# EAGLE design ButtonPad (EAGLE 8.5.0)
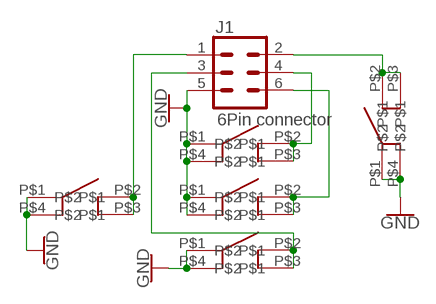
[diagram p0: schematic, sheet 1]

## Parts
J1  6Pin connector  CONN_03X22X3_SILK_MALE_PTH  [2X3]
U$1  BUTTON_GRAY_12MM  [BUTTON_12MM]
U$2  BUTTON_GRAY_12MM  [BUTTON_12MM]
U$3  BUTTON_GRAY_12MM  [BUTTON_12MM]
U$4  BUTTON_GRAY_12MM  [BUTTON_12MM]
U$5  BUTTON_GRAY_12MM  [BUTTON_12MM]

## Nets
GND: J1.5 U$1.P$1 U$1.P$4 U$2.P$1 U$2.P$4 U$3.P$1 U$3.P$4 U$4.P$1 U$4.P$4 U$5.P$1 U$5.P$4
N$1: J1.1 U$5.P$2 U$5.P$3
N$2: J1.3 U$3.P$2 U$3.P$3
N$3: J1.6 U$2.P$2 U$2.P$3
N$4: J1.4 U$1.P$2 U$1.P$3
N$5: J1.2 U$4.P$2 U$4.P$3

## Library data of the parts
J1 = SparkFun-Connectors:CONN_03X2: Multi connection point. Often used as Generic Header-pin footprint for 0.1 inch spaced/style header connections You can populate with any combo of single row headers, but if you'd like an exact match, check these: Header - 2x3 (Male, 0.1") <https://www.sparkfun.com/products/12807> (PRT-12807) Header - 2x3 (Female, 0.1") <https://www.sparkfun.com/products/13010> (PRT-13010) 2x3 Pin Shrouded Header <https://www.sparkfun.com/products/10877> (PRT-10877) On any of the 0.1 inch spaced packages, you can populate with these: Break Away Headers - Straight <https://www.sparkfun.com/products/116> (PRT-00116) Break Away Male Headers - Right Angle <https://www.sparkfun.com/products/553> (PRT-00553) Female Headers <https://www.sparkfun.com/products/115> (PRT-00115) Break Away Headers - Machine Pin <https://www.sparkfun.com/products/117> (PRT-00117) Break Away Female Headers - Swiss Machine Pin <https://www.sparkfun.com/products/743> (PRT-00743) Special note: the shrouded connector mates well with our 3x2 ribbon cables: Ribbon Crimp Connector - 6-pin (2x3, Female) <https://www.sparkfun.com/products/10651> (PRT-10651) Ribbon Cable - 6 wire (15ft) <https://www.sparkfun.com/products/10646> (PRT-10646); PROD_ID: CONN-09701
U$1-U$5 = HTXstuff:BUTTON_GRAY_12MM

## Board
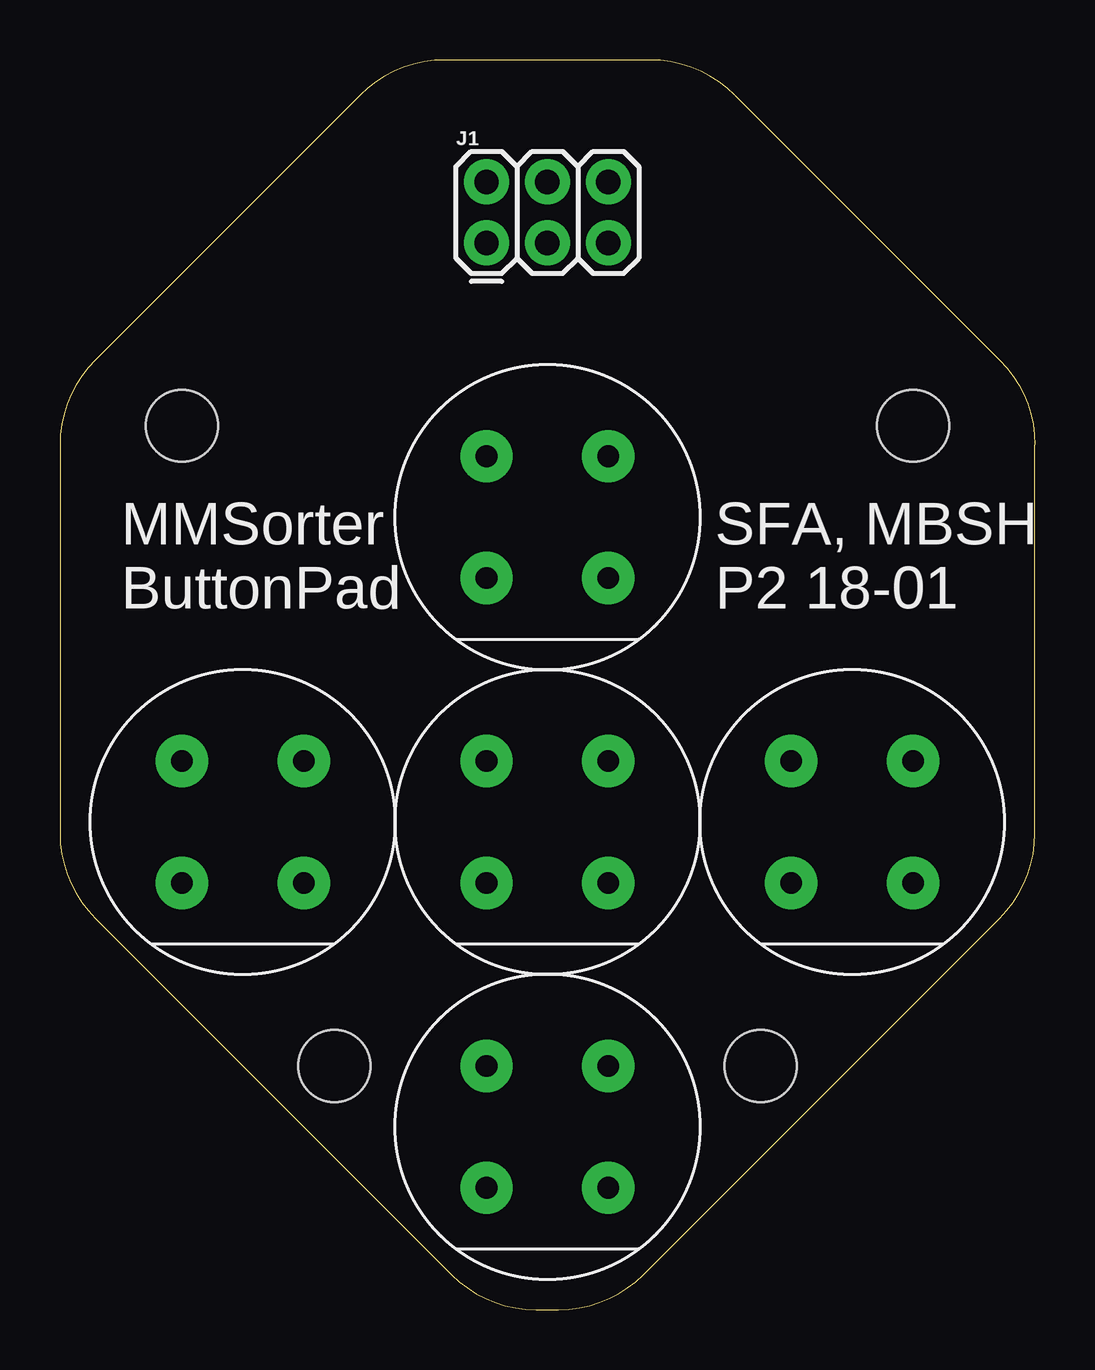
[diagram p1: board, top side]
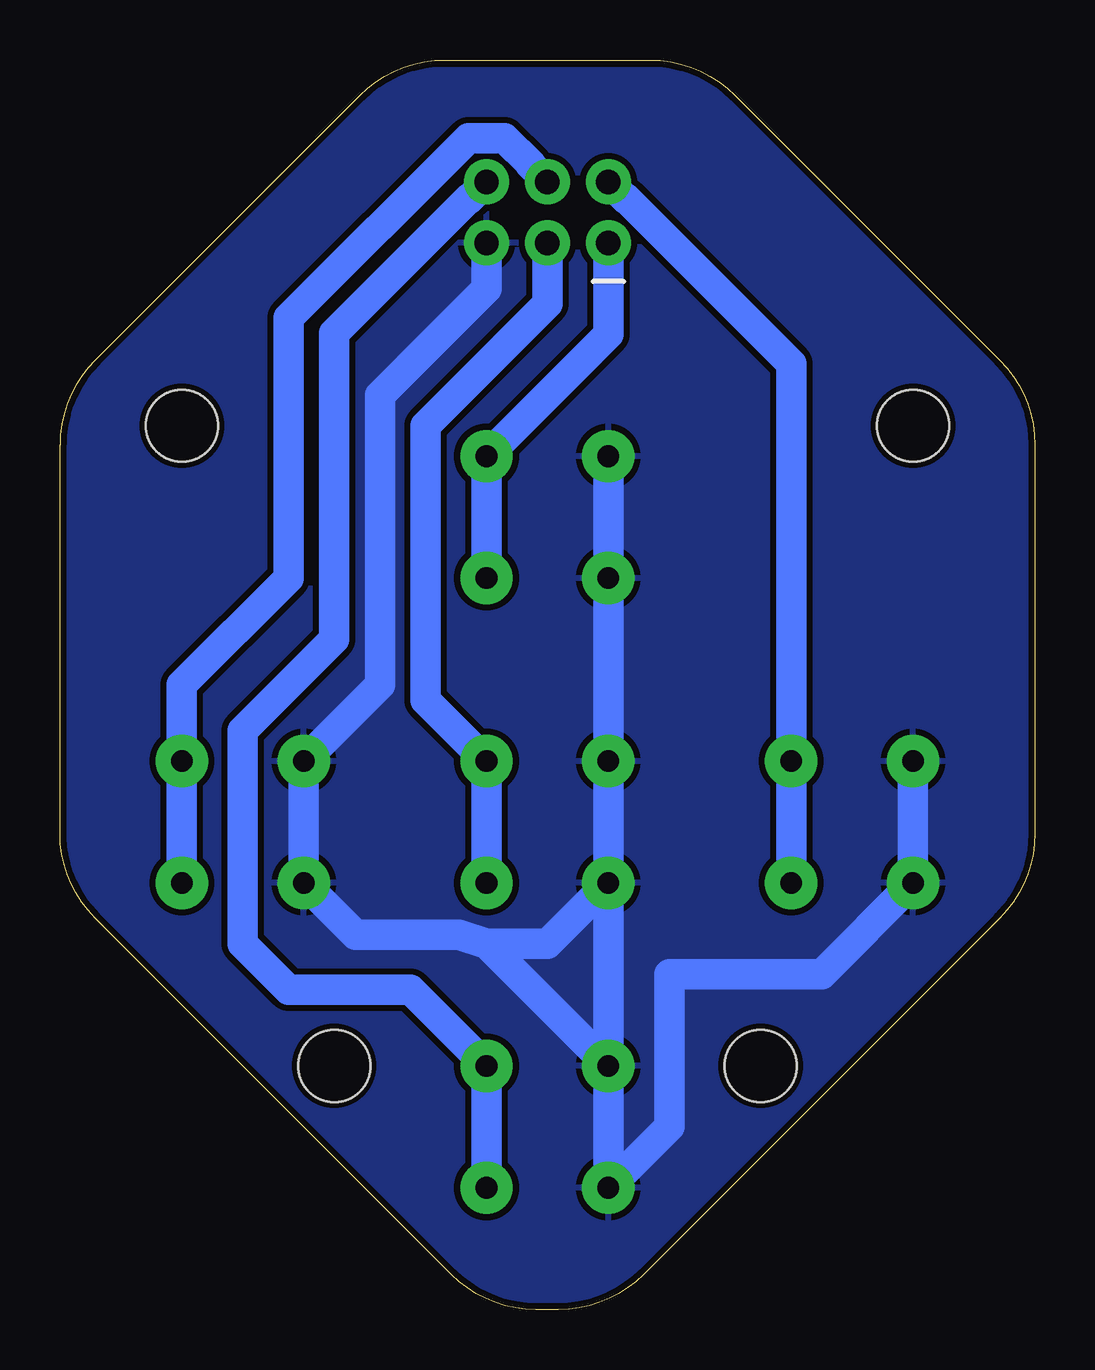
[diagram p2: board, bottom side, seen from below]

Size 40.64 x 52.07 mm. Coordinates in mm from the lower left corner, seen from the top.
Outline: 28.13,50.61 39.18,39.56 arc-45 40.64,36.03 40.64,19.85 arc-45 39.18,16.32 24.32,1.46 arc-45 20.79,0 19.85,0 arc-45 16.32,1.46 1.46,16.32 arc-45 0,19.85 0,36.03 arc-45 1.46,39.56 12.51,50.61 arc-45 16.04,52.07 24.6,52.07 arc-45 28.13,50.61
Copper layers (1*16): Top 0.035mm / dielectric 1.5mm / Bottom 0.035mm
Design rules "HTX *": minimum track width 10mil, minimum drill 0.35mm, track to track 10mil, track to pad 10mil, pad to pad 10mil, via to via 10mil, smd to smd 10mil, copper to edge 10mil, drill to drill 10mil, minimum pad ring 10mil, minimum via ring 8mil, stop-mask expansion 4mil, vias tented up to drill 0mil, thermal gap 10mil
Holes 3 mm at 29.21,10.16 11.43,10.16 5.08,36.83 35.56,36.83

### Footprints (pad centres in the part's own frame; a part is rotated, then mirrored left to right if it is on the bottom)
2X3 = drill 1.016 pad 1.88: 1 0,0; 2 0,2.54; 3 2.54,0; 4 2.54,2.54; 5 5.08,0; 6 5.08,2.54
BUTTON_12MM = drill 0.9 pad 2.184: P$1 -2.54,-2.54; P$2 2.54,-2.54; P$3 2.54,2.54; P$4 -2.54,2.54

### Placement (x,y rotation side)
J1  17.78,44.45 0 top
U$1  33.02,20.32 0 top
U$2  20.32,7.62 0 top
U$3  20.32,20.32 0 top
U$4  7.62,20.32 0 top
U$5  20.32,33.02 0 top

### Tracks (layer width: path | path; a pad name or v marks a point on that pad's centre or on a via)
GND
  Bottom 1.27: U$4.P$4 U$4.P$1 8.89,13.97 15.24,13.97 15.24,7.62 U$2.P$1 U$2.P$4 | U$2.P$4 U$3.P$1 | U$3.P$1 U$3.P$4 U$5.P$1 U$5.P$4 | U$2.P$4 22.86,15.24 | 22.86,15.24 24,15.62 28.32,15.62 U$1.P$1 U$1.P$4 27.3,26.04 27.3,38.1 22.86,42.55 J1.5 | U$3.P$1 20.32,15.24 22.86,15.24
  pour Bottom: 0,52.07 40.64,52.07 40.64,0 0,0
N$1
  Bottom 1.27: U$5.P$2 U$5.P$3 17.78,40.64 J1.1
N$2
  Bottom 1.27: J1.3 20.32,41.91 25.4,36.83 25.4,25.4 U$3.P$3 U$3.P$2
N$3
  Bottom 1.27: U$2.P$2 U$2.P$3 26.04,13.34 31.11,13.34 33.02,15.24 33.02,24.13 29.21,27.94 29.21,40.69 23.62,46.28 23.57,46.28 J1.6
N$4
  Bottom 1.27: U$1.P$2 U$1.P$3 35.56,26.04 31.11,30.48 31.11,41.32 23.62,48.82 22.1,48.82 21.03,47.75 21.03,47.7 J1.4
N$5
  Bottom 1.27: U$4.P$2 U$4.P$3 10.16,39.42 17.02,46.28 17.07,46.28 J1.2

### Text on the board
tNames: MMSorter / ButtonPad | SFA, MBSH / P2 18-01